# Altium schematic sheet 8x8x8 LED Cube.SchDoc
size A4; PageSetup: Record=PageOptions|CenterHorizontal=True|CenterVertical=True|PrintScale=0.71|XCorrection=1.00|YCorrection=1.00|PrintKind=1|BorderSize=5000000|LeftOffset=0|BottomOffset=0|Orientation=2|PaperLength=1000|PaperWidth=1000|Scale=100|PaperSource=15|PrintQuality=4000|MediaType=1|DitherType=10|PaperKind=A4|PrintScaleMode=1
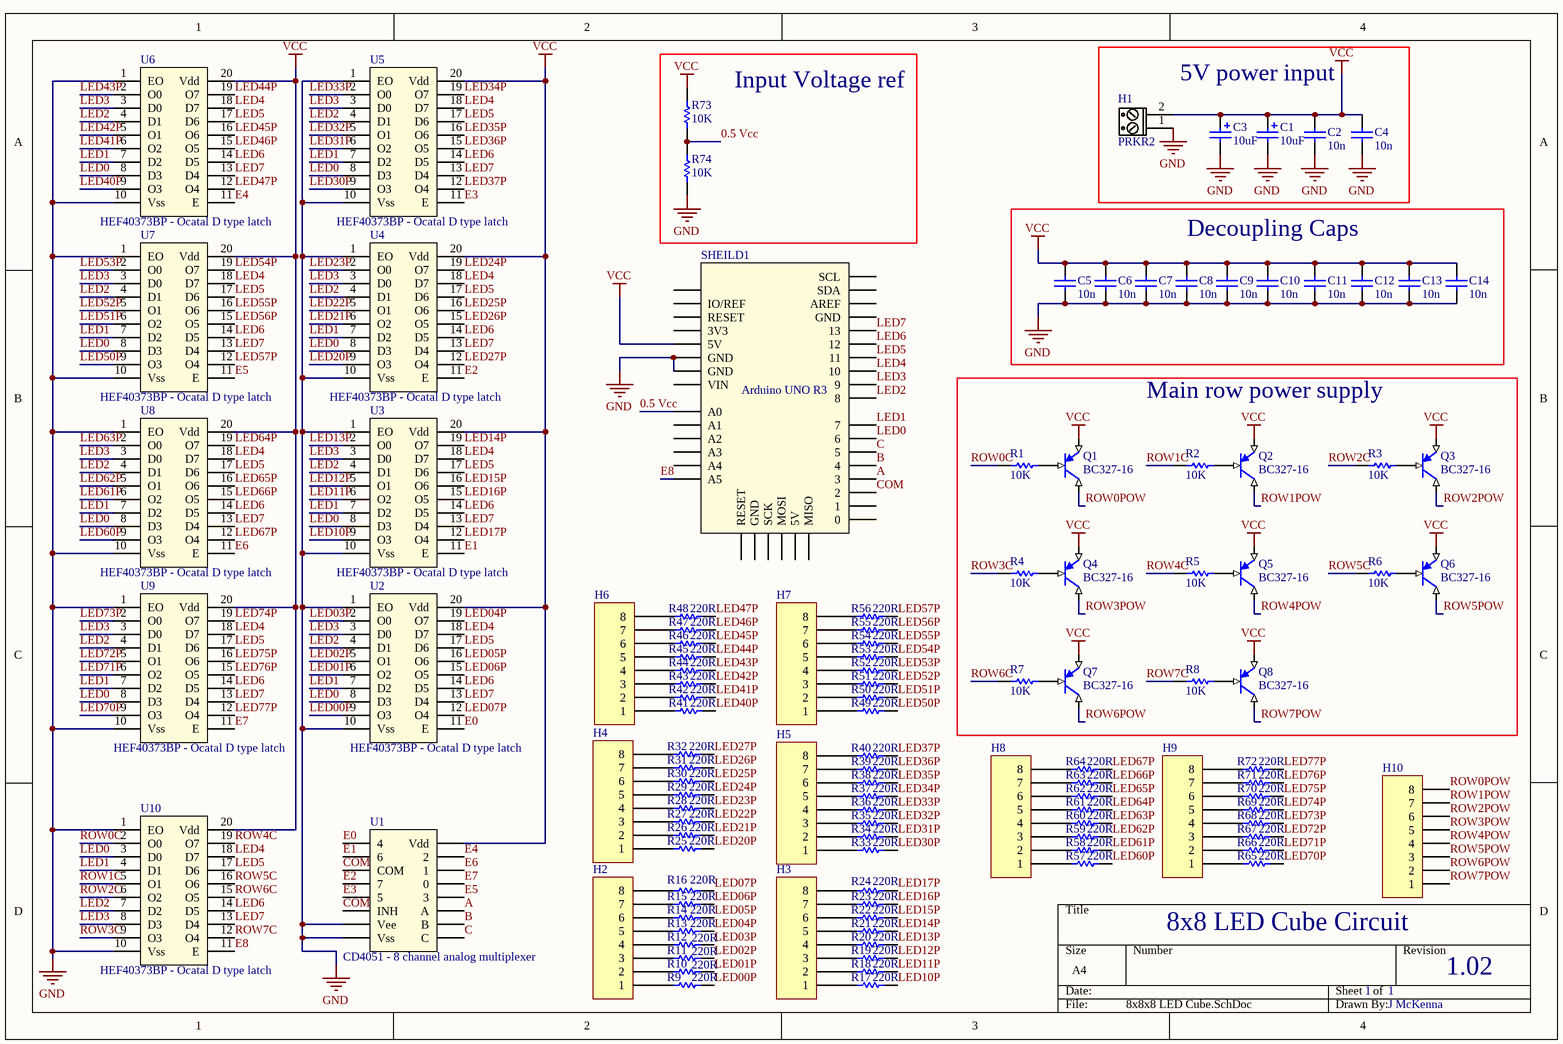
[diagram p0: 8x8x8 LED Cube.SchDoc]

## Parts
C1  value 10uF  [RB.15/.3]  (hidden comment: Cap Pol1)
C2  value 10n  [RAD300]  (hidden comment: Cap)
C3  value 10uF  [RB.15/.3]  (hidden comment: Cap Pol1)
C4  value 10n  [RAD300]  (hidden comment: Cap)
C5  value 10n  [RAD200_A]  (hidden comment: Cap)
C6  value 10n  [RAD200_A]  (hidden comment: Cap)
C7  value 10n  [RAD200_A]  (hidden comment: Cap)
C8  value 10n  [RAD200_A]  (hidden comment: Cap)
C9  value 10n  [RAD200_A]  (hidden comment: Cap)
C10  value 10n  [RAD200_A]  (hidden comment: Cap)
C11  value 10n  [RAD200_A]  (hidden comment: Cap)
C12  value 10n  [RAD200_A]  (hidden comment: Cap)
C13  value 10n  [RAD200_A]  (hidden comment: Cap)
C14  value 10n  [RAD200_A]  (hidden comment: Cap)
H1  PRKR2  [PRKR2]
H2  Header 98  [HDR1X8]  (value not drawn)
H3  Header 98  [HDR1X8]  (value not drawn)
H4  Header 98  [HDR1X8]  (value not drawn)
H5  Header 98  [HDR1X8]  (value not drawn)
H6  Header 98  [HDR1X8]  (value not drawn)
H7  Header 98  [HDR1X8]  (value not drawn)
H8  Header 98  [HDR1X8]  (value not drawn)
H9  Header 98  [HDR1X8]  (value not drawn)
H10  Header 98  [HDR1X8]  (value not drawn)
Q1  BC327-16  [TO-92A]
Q2  BC327-16  [TO-92A]
Q3  BC327-16  [TO-92A]
Q4  BC327-16  [TO-92A]
Q5  BC327-16  [TO-92A]
Q6  BC327-16  [TO-92A]
Q7  BC327-16  [TO-92A]
Q8  BC327-16  [TO-92A]
R1  value 10K  [AXIAL400]  (hidden comment: Res1)
R2  value 10K  [AXIAL400]  (hidden comment: Res1)
R3  value 10K  [AXIAL400]  (hidden comment: Res1)
R4  value 10K  [AXIAL400]  (hidden comment: Res1)
R5  value 10K  [AXIAL400]  (hidden comment: Res1)
R6  value 10K  [AXIAL400]  (hidden comment: Res1)
R7  value 10K  [AXIAL400]  (hidden comment: Res1)
R8  value 10K  [AXIAL400]  (hidden comment: Res1)
R9  value 220R  [AXIAL400]  (hidden comment: Res1)
R10  value 220R  [AXIAL400]  (hidden comment: Res1)
R11  value 220R  [AXIAL400]  (hidden comment: Res1)
R12  value 220R  [AXIAL400]  (hidden comment: Res1)
R13  value 220R  [AXIAL400]  (hidden comment: Res1)
R14  value 220R  [AXIAL400]  (hidden comment: Res1)
R15  value 220R  [AXIAL400]  (hidden comment: Res1)
R16  value 220R  [AXIAL400]  (hidden comment: Res1)
R17  value 220R  [AXIAL400]  (hidden comment: Res1)
R18  value 220R  [AXIAL400]  (hidden comment: Res1)
R19  value 220R  [AXIAL400]  (hidden comment: Res1)
R20  value 220R  [AXIAL400]  (hidden comment: Res1)
R21  value 220R  [AXIAL400]  (hidden comment: Res1)
R22  value 220R  [AXIAL400]  (hidden comment: Res1)
R23  value 220R  [AXIAL400]  (hidden comment: Res1)
R24  value 220R  [AXIAL400]  (hidden comment: Res1)
R25  value 220R  [AXIAL400]  (hidden comment: Res1)
R26  value 220R  [AXIAL400]  (hidden comment: Res1)
R27  value 220R  [AXIAL400]  (hidden comment: Res1)
R28  value 220R  [AXIAL400]  (hidden comment: Res1)
R29  value 220R  [AXIAL400]  (hidden comment: Res1)
R30  value 220R  [AXIAL400]  (hidden comment: Res1)
R31  value 220R  [AXIAL400]  (hidden comment: Res1)
R32  value 220R  [AXIAL400]  (hidden comment: Res1)
R33  value 220R  [AXIAL400]  (hidden comment: Res1)
R34  value 220R  [AXIAL400]  (hidden comment: Res1)
R35  value 220R  [AXIAL400]  (hidden comment: Res1)
R36  value 220R  [AXIAL400]  (hidden comment: Res1)
R37  value 220R  [AXIAL400]  (hidden comment: Res1)
R38  value 220R  [AXIAL400]  (hidden comment: Res1)
R39  value 220R  [AXIAL400]  (hidden comment: Res1)
R40  value 220R  [AXIAL400]  (hidden comment: Res1)
R41  value 220R  [AXIAL400]  (hidden comment: Res1)
R42  value 220R  [AXIAL400]  (hidden comment: Res1)
R43  value 220R  [AXIAL400]  (hidden comment: Res1)
R44  value 220R  [AXIAL400]  (hidden comment: Res1)
R45  value 220R  [AXIAL400]  (hidden comment: Res1)
R46  value 220R  [AXIAL400]  (hidden comment: Res1)
R47  value 220R  [AXIAL400]  (hidden comment: Res1)
R48  value 220R  [AXIAL400]  (hidden comment: Res1)
R49  value 220R  [AXIAL400]  (hidden comment: Res1)
R50  value 220R  [AXIAL400]  (hidden comment: Res1)
R51  value 220R  [AXIAL400]  (hidden comment: Res1)
R52  value 220R  [AXIAL400]  (hidden comment: Res1)
R53  value 220R  [AXIAL400]  (hidden comment: Res1)
R54  value 220R  [AXIAL400]  (hidden comment: Res1)
R55  value 220R  [AXIAL400]  (hidden comment: Res1)
R56  value 220R  [AXIAL400]  (hidden comment: Res1)
R57  value 220R  [AXIAL400]  (hidden comment: Res1)
R58  value 220R  [AXIAL400]  (hidden comment: Res1)
R59  value 220R  [AXIAL400]  (hidden comment: Res1)
R60  value 220R  [AXIAL400]  (hidden comment: Res1)
R61  value 220R  [AXIAL400]  (hidden comment: Res1)
R62  value 220R  [AXIAL400]  (hidden comment: Res1)
R63  value 220R  [AXIAL400]  (hidden comment: Res1)
R64  value 220R  [AXIAL400]  (hidden comment: Res1)
R65  value 220R  [AXIAL400]  (hidden comment: Res1)
R66  value 220R  [AXIAL400]  (hidden comment: Res1)
R67  value 220R  [AXIAL400]  (hidden comment: Res1)
R68  value 220R  [AXIAL400]  (hidden comment: Res1)
R69  value 220R  [AXIAL400]  (hidden comment: Res1)
R70  value 220R  [AXIAL400]  (hidden comment: Res1)
R71  value 220R  [AXIAL400]  (hidden comment: Res1)
R72  value 220R  [AXIAL400]  (hidden comment: Res1)
R73  value 10K  [AXIAL400]  (hidden comment: Res1)
R74  value 10K  [AXIAL400]  (hidden comment: Res1)
SHEILD1  Arduino UNO sheild  [Arduino UNO R3]  (value not drawn)
U1  CD4051 - 8 channel analog multiplexer  [DIP16]
U2  HEF40373BP - Ocatal D type latch  [DIP20]
U3  HEF40373BP - Ocatal D type latch  [DIP20]
U4  HEF40373BP - Ocatal D type latch  [DIP20]
U5  HEF40373BP - Ocatal D type latch  [DIP20]
U6  HEF40373BP - Ocatal D type latch  [DIP20]
U7  HEF40373BP - Ocatal D type latch  [DIP20]
U8  HEF40373BP - Ocatal D type latch  [DIP20]
U9  HEF40373BP - Ocatal D type latch  [DIP20]
U10  HEF40373BP - Ocatal D type latch  [DIP20]

## Blocks framed on the sheet
Input Voltage ref: R73 R74
5V power input: C1-C4 H1
Decoupling Caps: C5-C14
Main row power supply: Q1-Q8 R1-R8

## Nets
GND: C1.2 C2.2 C3.2 C4.1 C5.1 C6.1 C7.1 C8.1 C9.1 C10.1 C11.1 C12.1 C13.1 C14.1 H1.1 R74.1 SHEILD1.6(GND) SHEILD1.7(GND) U1.7(Vee) U1.8(Vss) U2.1(EO) U2.10(Vss) U3.1(EO) U3.10(Vss) U4.1(EO) U4.10(Vss) U5.1(EO) U5.10(Vss) U6.1(EO) U6.10(Vss) U7.1(EO) U7.10(Vss) U8.1(EO) U8.10(Vss) U9.1(EO) U9.10(Vss) U10.1(EO) U10.10(Vss)
VCC: C1.1 C2.1 C3.1 C4.2 C5.2 C6.2 C7.2 C8.2 C9.2 C10.2 C11.2 C12.2 C13.2 C14.2 H1.2 Q1.3(E) Q2.3(E) Q3.3(E) Q4.3(E) Q5.3(E) Q6.3(E) Q7.3(E) Q8.3(E) R73.2 SHEILD1.5(5V) U1.16(Vdd) U2.20(Vdd) U3.20(Vdd) U4.20(Vdd) U5.20(Vdd) U6.20(Vdd) U7.20(Vdd) U8.20(Vdd) U9.20(Vdd) U10.20(Vdd)
0.5 Vcc: R73.1 R74.2 SHEILD1.9(A0)
A: SHEILD1.18(3) U1.11(A)
B: SHEILD1.19(4) U1.10(B)
C: SHEILD1.20(5) U1.9(C)
COM: SHEILD1.17(2) U1.3(COM) U1.6(INH)
E0: U1.1(4) U2.11(E)
E1: U1.2(6) U3.11(E)
E2: U1.4(7) U4.11(E)
E3: U1.5 U5.11(E)
E4: U1.15(2) U6.11(E)
E5: U1.12(3) U7.11(E)
E6: U1.14(1) U8.11(E)
E7: U1.13(0) U9.11(E)
E8: SHEILD1.14(A5) U10.11(E)
LED0: SHEILD1.21(6) U2.8(D3) U3.8(D3) U4.8(D3) U5.8(D3) U6.8(D3) U7.8(D3) U8.8(D3) U9.8(D3) U10.3(D0)
LED00P: R9.2 U2.9(O3)
LED1: SHEILD1.22(7) U2.7(D2) U3.7(D2) U4.7(D2) U5.7(D2) U6.7(D2) U7.7(D2) U8.7(D2) U9.7(D2) U10.4(D1)
LED01P: R10.2 U2.6(O2)
LED2: SHEILD1.23(8) U2.4(D1) U3.4(D1) U4.4(D1) U5.4(D1) U6.4(D1) U7.4(D1) U8.4(D1) U9.4(D1) U10.7(D2)
LED02P: R11.2 U2.5(O1)
LED3: SHEILD1.24(9) U2.3(D0) U3.3(D0) U4.3(D0) U5.3(D0) U6.3(D0) U7.3(D0) U8.3(D0) U9.3(D0) U10.8(D3)
LED03P: R12.2 U2.2(O0)
LED4: SHEILD1.25(10) U2.18(D7) U3.18(D7) U4.18(D7) U5.18(D7) U6.18(D7) U7.18(D7) U8.18(D7) U9.18(D7) U10.18(D7)
LED04P: R13.2 U2.19(O7)
LED5: SHEILD1.26(11) U2.17(D6) U3.17(D6) U4.17(D6) U5.17(D6) U6.17(D6) U7.17(D6) U8.17(D6) U9.17(D6) U10.17(D6)
LED05P: R14.2 U2.16(O6)
LED6: SHEILD1.27(12) U2.14(D5) U3.14(D5) U4.14(D5) U5.14(D5) U6.14(D5) U7.14(D5) U8.14(D5) U9.14(D5) U10.14(D5)
LED06P: R15.2 U2.15(O5)
LED7: SHEILD1.28(13) U2.13(D4) U3.13(D4) U4.13(D4) U5.13(D4) U6.13(D4) U7.13(D4) U8.13(D4) U9.13(D4) U10.13(D4)
LED07P: R16.2 U2.12(O4)
LED10P: R17.2 U3.9(O3)
LED11P: R18.2 U3.6(O2)
LED12P: R19.2 U3.5(O1)
LED13P: R20.2 U3.2(O0)
LED14P: R21.2 U3.19(O7)
LED15P: R22.2 U3.16(O6)
LED16P: R23.2 U3.15(O5)
LED17P: R24.2 U3.12(O4)
LED20P: R25.2 U4.9(O3)
LED21P: R26.2 U4.6(O2)
LED22P: R27.2 U4.5(O1)
LED23P: R28.2 U4.2(O0)
LED24P: R29.2 U4.19(O7)
LED25P: R30.2 U4.16(O6)
LED26P: R31.2 U4.15(O5)
LED27P: R32.2 U4.12(O4)
LED30P: R33.2 U5.9(O3)
LED31P: R34.2 U5.6(O2)
LED32P: R35.2 U5.5(O1)
LED33P: R36.2 U5.2(O0)
LED34P: R37.2 U5.19(O7)
LED35P: R38.2 U5.16(O6)
LED36P: R39.2 U5.15(O5)
LED37P: R40.2 U5.12(O4)
LED40P: R41.2 U6.9(O3)
LED41P: R42.2 U6.6(O2)
LED42P: R43.2 U6.5(O1)
LED43P: R44.2 U6.2(O0)
LED44P: R45.2 U6.19(O7)
LED45P: R46.2 U6.16(O6)
LED46P: R47.2 U6.15(O5)
LED47P: R48.2 U6.12(O4)
LED50P: R49.2 U7.9(O3)
LED51P: R50.2 U7.6(O2)
LED52P: R51.2 U7.5(O1)
LED53P: R52.2 U7.2(O0)
LED54P: R53.2 U7.19(O7)
LED55P: R54.2 U7.16(O6)
LED56P: R55.2 U7.15(O5)
LED57P: R56.2 U7.12(O4)
LED60P: R57.2 U8.9(O3)
LED61P: R58.2 U8.6(O2)
LED62P: R59.2 U8.5(O1)
LED63P: R60.2 U8.2(O0)
LED64P: R61.2 U8.19(O7)
LED65P: R62.2 U8.16(O6)
LED66P: R63.2 U8.15(O5)
LED67P: R64.2 U8.12(O4)
LED70P: R65.2 U9.9(O3)
LED71P: R66.2 U9.6(O2)
LED72P: R67.2 U9.5(O1)
LED73P: R68.2 U9.2(O0)
LED74P: R69.2 U9.19(O7)
LED75P: R70.2 U9.16(O6)
LED76P: R71.2 U9.15(O5)
LED77P: R72.2 U9.12(O4)
ROW0C: R1.1 U10.2(O0)
ROW0POW: H10.8 Q1.1(C)
ROW1C: R2.1 U10.5(O1)
ROW1POW: H10.7 Q2.1(C)
ROW2C: R3.1 U10.6(O2)
ROW2POW: H10.6 Q3.1(C)
ROW3C: R4.1 U10.9(O3)
ROW3POW: H10.5 Q4.1(C)
ROW4C: R5.1 U10.19(O7)
ROW4POW: H10.4 Q5.1(C)
ROW5C: R6.1 U10.16(O6)
ROW5POW: H10.3 Q6.1(C)
ROW6C: R7.1 U10.15(O5)
ROW6POW: H10.2 Q7.1(C)
ROW7C: R8.1 U10.12(O4)
ROW7POW: H10.1 Q8.1(C)
NetH2_1: H2.1 R9.1
NetH2_2: H2.2 R10.1
NetH2_3: H2.3 R11.1
NetH2_4: H2.4 R12.1
NetH2_5: H2.5 R13.1
NetH2_6: H2.6 R14.1
NetH2_7: H2.7 R15.1
NetH2_8: H2.8 R16.1
NetH3_1: H3.1 R17.1
NetH3_2: H3.2 R18.1
NetH3_3: H3.3 R19.1
NetH3_4: H3.4 R20.1
NetH3_5: H3.5 R21.1
NetH3_6: H3.6 R22.1
NetH3_7: H3.7 R23.1
NetH3_8: H3.8 R24.1
NetH4_1: H4.1 R25.1
NetH4_2: H4.2 R26.1
NetH4_3: H4.3 R27.1
NetH4_4: H4.4 R28.1
NetH4_5: H4.5 R29.1
NetH4_6: H4.6 R30.1
NetH4_7: H4.7 R31.1
NetH4_8: H4.8 R32.1
NetH5_1: H5.1 R33.1
NetH5_2: H5.2 R34.1
NetH5_3: H5.3 R35.1
NetH5_4: H5.4 R36.1
NetH5_5: H5.5 R37.1
NetH5_6: H5.6 R38.1
NetH5_7: H5.7 R39.1
NetH5_8: H5.8 R40.1
NetH6_1: H6.1 R41.1
NetH6_2: H6.2 R42.1
NetH6_3: H6.3 R43.1
NetH6_4: H6.4 R44.1
NetH6_5: H6.5 R45.1
NetH6_6: H6.6 R46.1
NetH6_7: H6.7 R47.1
NetH6_8: H6.8 R48.1
NetH7_1: H7.1 R49.1
NetH7_2: H7.2 R50.1
NetH7_3: H7.3 R51.1
NetH7_4: H7.4 R52.1
NetH7_5: H7.5 R53.1
NetH7_6: H7.6 R54.1
NetH7_7: H7.7 R55.1
NetH7_8: H7.8 R56.1
NetH8_1: H8.1 R57.1
NetH8_2: H8.2 R58.1
NetH8_3: H8.3 R59.1
NetH8_4: H8.4 R60.1
NetH8_5: H8.5 R61.1
NetH8_6: H8.6 R62.1
NetH8_7: H8.7 R63.1
NetH8_8: H8.8 R64.1
NetH9_1: H9.1 R65.1
NetH9_2: H9.2 R66.1
NetH9_3: H9.3 R67.1
NetH9_4: H9.4 R68.1
NetH9_5: H9.5 R69.1
NetH9_6: H9.6 R70.1
NetH9_7: H9.7 R71.1
NetH9_8: H9.8 R72.1
NetQ1_2: Q1.2(B) R1.2
NetQ2_2: Q2.2(B) R2.2
NetQ3_2: Q3.2(B) R3.2
NetQ4_2: Q4.2(B) R4.2
NetQ5_2: Q5.2(B) R5.2
NetQ6_2: Q6.2(B) R6.2
NetQ7_2: Q7.2(B) R7.2
NetQ8_2: Q8.2(B) R8.2

Not connected (* = marked no-connect by the designer): SHEILD1 1 2(IO/REF) 3(RESET) 4(3V3) 8(VIN) 10(A1) 11(A2) 12(A3) 13(A4) 15(0) 16(1) 29(GND) 30(AREF) 31(SDA) 32(SCL) 33(RESET) 34(GND) 35(SCK) 36(MOSI) 37(5V) 38(MISO)

## Notes on the sheet
- (near H10) 8x8 LED Cube Circuit
- 1
- 1.02
- J McKenna
- (in symbol Arduino UNO sheild) Arduino UNO R3

## Library data of the parts
C1 C3 = Cap Pol1: Polarized Capacitor (Radial); Manufacturer: Generic Components; Class: Passive; Published: 08/06/2000; Publisher: Altium Hobart Technology Centre; SubClass: Capacitor
C2 C4-C14 = Cap: Capacitor; Manufacturer: Generic Components; Class: Passive; Published: 08/06/2000; Publisher: Altium Hobart Technology Centre; SubClass: Capacitor
H1 = PRKR2: SCREW TERMINAL 5MM
H2-H10 = Header 8: Header, 8-Pin; Manufacturer: Generic Components; Class: Connector
Q1-Q8 = BC327-16: PNP BJT
R1-R74 = Res1: Resistor; Manufacturer: Generic Components; Class: Passive; Published: 08/06/2000; Publisher: Altium Hobart Technology Centre; SubClass: Resistor